# EAGLE schematic IV-CC3200MOD (EAGLE 7.1.0)
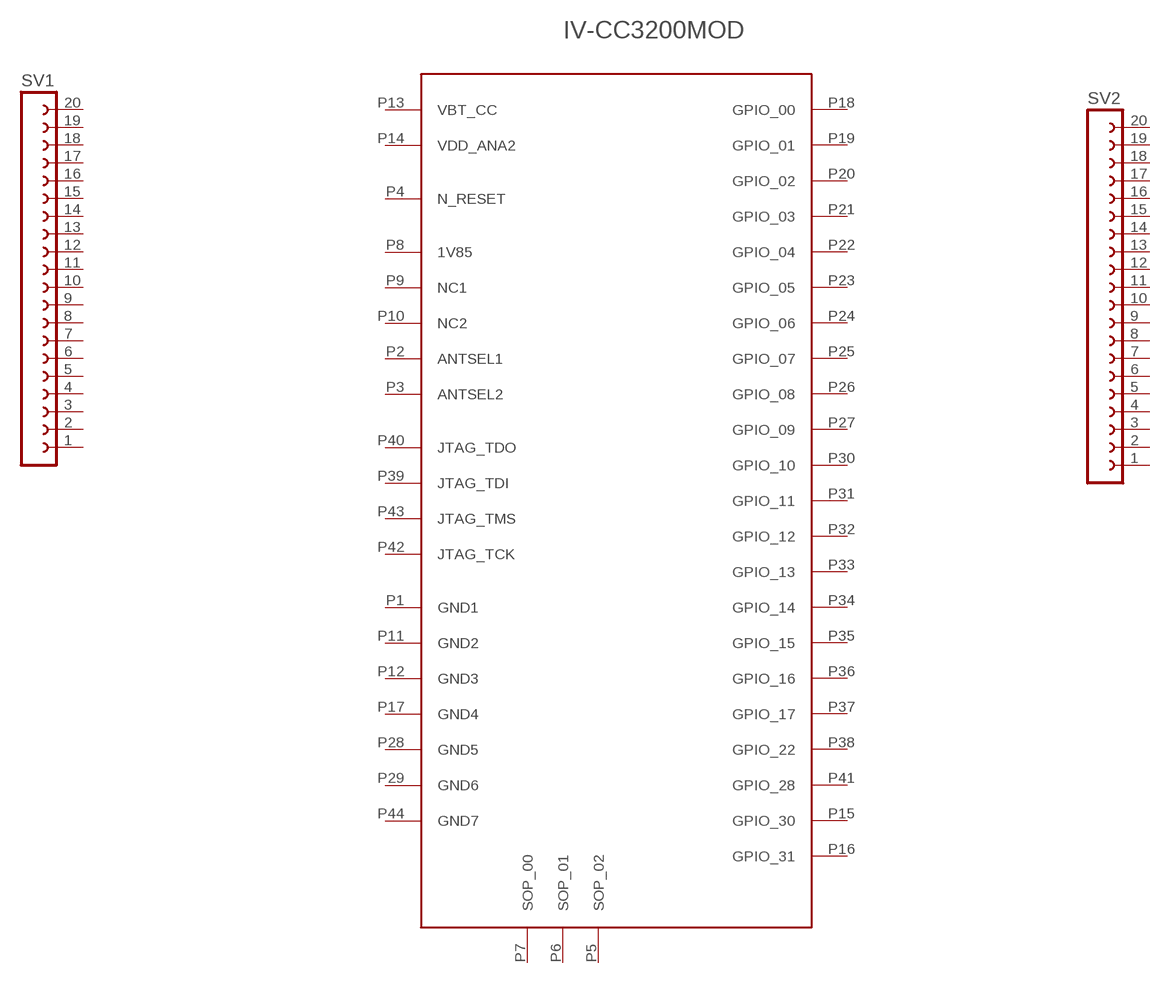
[diagram p0: schematic, sheet 1]

## Parts
SV1  FE20-1  [FE20]
SV2  FE20-1  [FE20]
U$1  IV-CC3200MOD  [CC3200]
Unconnected: SV1.1 SV1.2 SV1.3 SV1.4 SV1.5 SV1.6 SV1.7 SV1.8 SV1.9 SV1.10 SV1.11 SV1.12 SV1.13 SV1.14 SV1.15 SV1.16 SV1.17 SV1.18 SV1.19 SV1.20 SV2.1 SV2.2 SV2.3 SV2.4 SV2.5 SV2.6 SV2.7 SV2.8 SV2.9 SV2.10 SV2.11 SV2.12 SV2.13 SV2.14 SV2.15 SV2.16 SV2.17 SV2.18 SV2.19 SV2.20 U$1.P1(GND1) U$1.P2(ANTSEL1) U$1.P3(ANTSEL2) U$1.P4(N_RESET) U$1.P5(SOP_02) U$1.P6(SOP_01) U$1.P7(SOP_00) U$1.P8(1V85) U$1.P9(NC1) U$1.P10(NC2) U$1.P11(GND2) U$1.P12(GND3) U$1.P13(VBT_CC) U$1.P14(VDD_ANA2) U$1.P15(GPIO_30) U$1.P16(GPIO_31) U$1.P17(GND4) U$1.P18(GPIO_00) U$1.P19(GPIO_01) U$1.P20(GPIO_02) U$1.P21(GPIO_03) U$1.P22(GPIO_04) U$1.P23(GPIO_05) U$1.P24(GPIO_06) U$1.P25(GPIO_07) U$1.P26(GPIO_08) U$1.P27(GPIO_09) U$1.P28(GND5) U$1.P29(GND6) U$1.P30(GPIO_10) U$1.P31(GPIO_11) U$1.P32(GPIO_12) U$1.P33(GPIO_13) U$1.P34(GPIO_14) U$1.P35(GPIO_15) U$1.P36(GPIO_16) U$1.P37(GPIO_17) U$1.P38(GPIO_22) U$1.P39(JTAG_TDI) U$1.P40(JTAG_TDO) U$1.P41(GPIO_28) U$1.P42(JTAG_TCK) U$1.P43(JTAG_TMS) U$1.P44(GND7)

## Library data of the parts
SV1 SV2 = con-lsta:FE20-1: FEMALE HEADER; OC_FARNELL: unknown; OC_NEWARK: unknown
U$1 = IV-CC3200MOD:IV-CC3200MOD